# Altium schematic sheet Sheet1.SchDoc
size A3; SheetNumber: 1; SheetTotal: 1
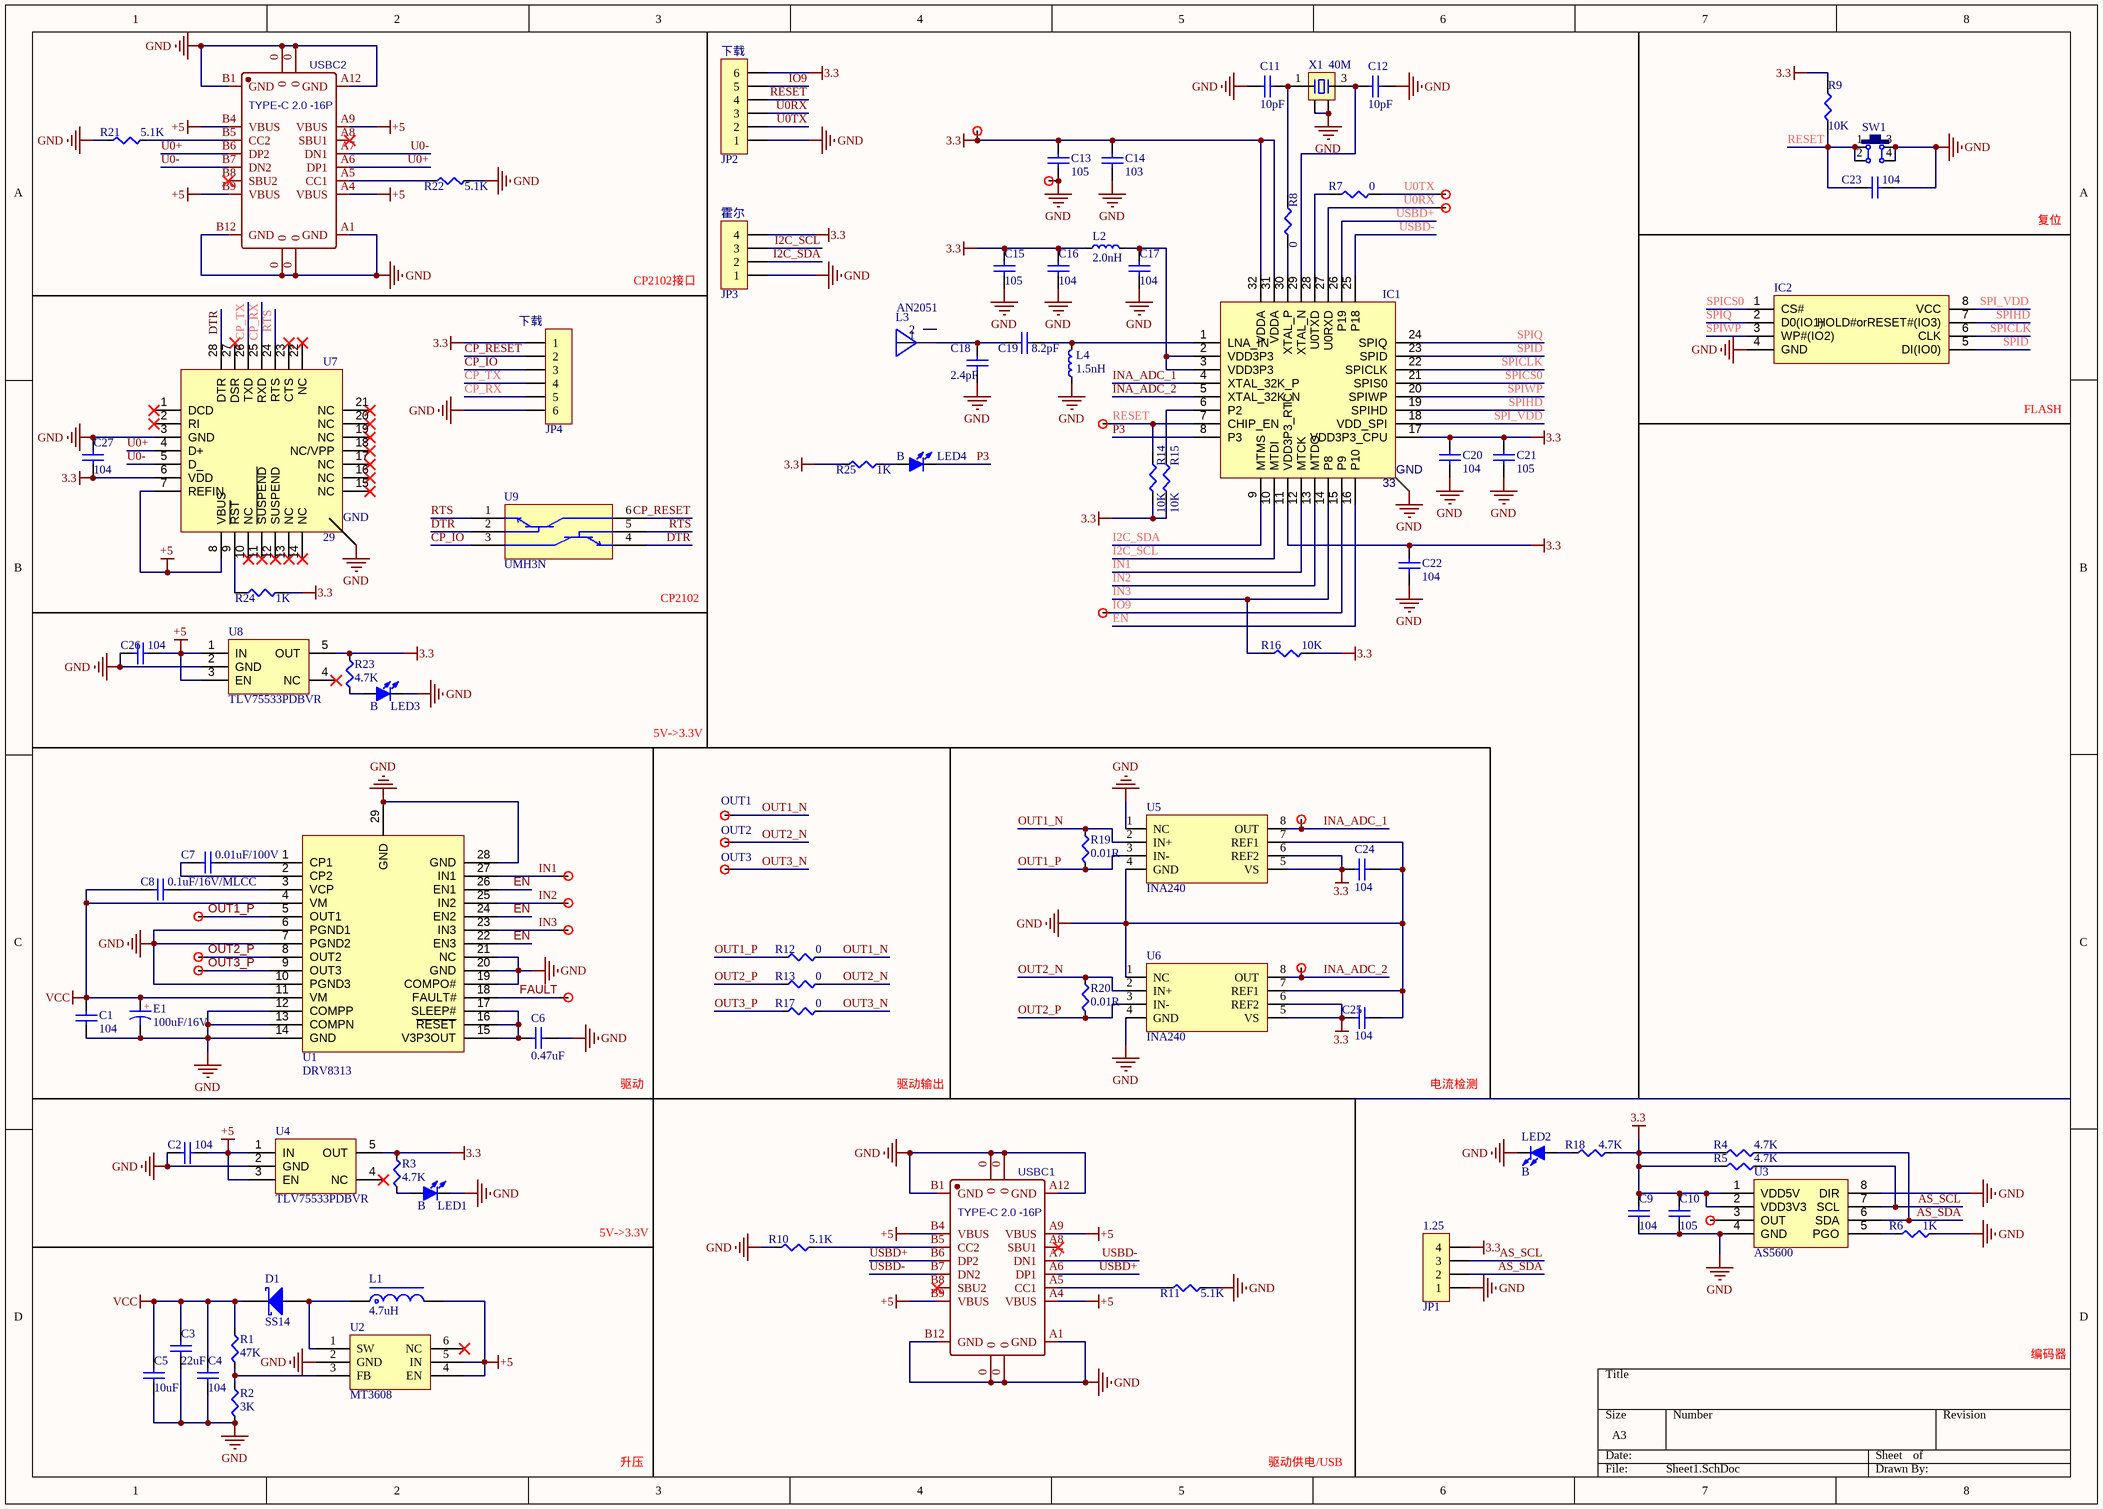
[diagram p0: Sheet1.SchDoc]

## Parts
C1  104  [C 0603_L]
C2  104  [C 0603_L]
C3  22uF  [C 1206_L]
C4  104  [C 0603_L]
C5  10uF  [C 0603_L]
C6  0.47uF  [C 0603_L]
C7  0.01uF/100V  [C 0603_L]
C8  0.1uF/16V/MLCC  [C 0603_L]
C9  104  [C 0603_L]
C10  105  [C 0603_L]
C11  10pF  [C 0603_L]
C12  10pF  [C 0603_L]
C13  105  [C 0603_L]
C14  103  [C 0603_L]
C15  105  [C 0603_L]
C16  104  [C 0603_L]
C17  104  [C 0603_L]
C18  2.4pF  [C 0603_L]
C19  8.2pF  [C 0603_L]
C20  104  [C 0603_L]
C21  105  [C 0603_L]
C22  104  [C 0603_L]
C23  104  [C 0603_L]
C24  104  [C 0603_L]
C25  104  [C 0603_L]
C26  104  [C 0603_L]
C27  104  [C 0603_L]
D1  SS14  [SMA]
E1  100uF/16V  [CM D(6.3*5.4)]
HP1  HP  [HP1x0.5]  (value not drawn)
HP2  HP  [HP1x0.5]  (value not drawn)
HP3  HP  [HP1x0.5]  (value not drawn)
HP4  HP  [HP1x0.5]  (value not drawn)
HP5  HP  [HP1x0.5]  (value not drawn)
HP6  HP  [HP1x0.5]  (value not drawn)
HP7  HP  [HP1x0.5]  (value not drawn)
HP8  HP  [HP1x0.5]  (value not drawn)
HP9  OUT1  [HP1x0.5]
HP10  OUT2  [HP1x0.5]
HP11  OUT3  [HP1x0.5]
HP12  HP  [HP1x0.5]  (value not drawn)
HP13  HP  [HP1x0.5]  (value not drawn)
HP14  HP  [HP1x0.5]  (value not drawn)
HP15  HP  [HP1x0.5]  (value not drawn)
HP16  HP  [HP1x0.5]  (value not drawn)
HP17  HP  [HP1x0.5]  (value not drawn)
HP18  HP  [HP1x0.5]  (value not drawn)
HP19  HP  [HP1x0.5]  (value not drawn)
IC1  ESP32-C3  [ESP32-C3]  (value not drawn)
IC2  W25Q64  [SOIC-8W]  (value not drawn)
JP1  HDR-1X4  [MX 1.25-WI-4P]  (value not drawn)
JP2  HDR-1X6  [MX 1.25-WI-6P]  (value not drawn)
JP3  HDR-1X4  [MX 1.25-WI-4P]  (value not drawn)
JP4  HDR-1X6  [MX 1.25-WI-6P]  (value not drawn)
L1  4.7uH  [NR4020]
L2  2.0nH  [L 0805]
L3  AN2051  [AN2051-245 2.4G]
L4  1.5nH  [L 0805]
LED1  B  [LED 0603B]
LED2  B  [LED 0603B]
LED3  B  [LED 0603B]
LED4  B  [LED 0603B]
R1  47K  [R 0603_L]
R2  3K  [R 0603_L]
R3  4.7K  [R 0603_L]
R4  4.7K  [R 0603_L]
R5  4.7K  [R 0603_L]
R6  1K  [R 0603_L]
R7  0  [R 0603_L]
R8  0  [R 0603_L]
R9  10K  [R 0603_L]
R10  5.1K  [R 0603_L]
R11  5.1K  [R 0603_L]
R12  0  [R 0603_L]
R13  0  [R 0603_L]
R14  10K  [R 0603_L]
R15  10K  [R 0603_L]
R16  10K  [R 0603_L]
R17  0  [R 0603_L]
R18  4.7K  [R 0603_L]
R19  0.01R  [R 1206_L]
R20  0.01R  [R 1210_L]
R21  5.1K  [R 0603_L]
R22  5.1K  [R 0603_L]
R23  4.7K  [R 0603_L]
R24  1K  [R 0603_L]
R25  1K  [R 0603_L]
SW1  3.2x4.2x5  [TSW SMD 3.2*4.2*2.5]  (value not drawn)
U1  DRV8313  [HTSSOP-28-EP-4.5mm]
U2  MT3608  [SOT23-6L]
U3  AS5600  [SOIC-8]
U4  TLV75533PDBVR  [SOT23-5L]
U5  INA240  [TSSOP8_N]
U6  INA240  [TSSOP8_N]
U7  CP2102  [QFN28 5x5_M]  (value not drawn)
U8  TLV75533PDBVR  [SOT23-5L]
U9  UMH3N  [SOT-363]
USBC1  TYPE-C 2.0 -16P  [USB-C-SMD_TYPE-C-USB-5]
USBC2  TYPE-C 2.0 -16P  [USB-C-SMD_TYPE-C-USB-5]
X1  40M  [OSC 3225-4P]

## Nets
3.3: C9.2 C10.2 C13.2 C14.2 C15.2 C16.2 C20.2 C21.2 C22.2 C24.2 C25.1 C27.1 HP18.1 IC1.11(VDD3P3_RTC) IC1.17(VDD3P3_CPU) IC1.31(VDDA) IC1.32(VDDA) JP1.4 JP2.6 JP3.4 JP4.1 L2.1 R3.2 R4.1 R5.1 R9.2 R14.1 R15.1 R16.2 R18.2 R23.2 R24.1 R25.1 U3.1(VDD5V) U3.2(VDD3V3) U4.5(OUT) U5.5(VS) U5.6(REF2) U6.5(VS) U6.6(REF2) U7.6(VDD) U8.5(OUT)
+5: C2.2 C26.2 L1.2 U2.4(EN) U2.5(IN) U4.1(IN) U4.3(EN) U7.7(REFIN) U7.8(VBUS) U8.1(IN) U8.3(EN) USBC1.A4(VBUS) USBC1.A9(VBUS) USBC1.B4(VBUS) USBC1.B9(VBUS) USBC2.A4(VBUS) USBC2.A9(VBUS) USBC2.B4(VBUS) USBC2.B9(VBUS)
GND: C1.1 C2.1 C3.1 C4.1 C5.1 C6.1 C9.1 C10.1 C11.1 C12.2 C13.1 C14.1 C15.1 C16.1 C17.1 C18.1 C20.1 C21.1 C22.1 C23.2 C24.1 C25.2 C26.1 C27.2 E1.2 HP19.1 IC1.33(GND) IC2.4(GND) JP1.1 JP2.1 JP3.1 JP4.6 L4.1 LED1.2(K) LED2.2(K) LED3.2(K) R2.1 R6.2 R10.1 R11.2 R21.1 R22.2 SW1.3 SW1.4 U1.6(PGND1) U1.7(PGND2) U1.10(PGND3) U1.12(COMPP) U1.13(COMPN) U1.14(GND) U1.19(COMPO#) U1.20(GND) U1.21(NC) U1.28(GND) U1.29(GND) U2.2(GND) U3.4(GND) U3.8(DIR) U4.2(GND) U5.1(NC) U5.4(GND) U5.7(REF1) U6.1(NC) U6.4(GND) U6.7(REF1) U7.3(GND) U7.29(GND) U8.2(GND) USBC1.0 USBC1.A1(GND) USBC1.A12(GND) USBC1.B1(GND) USBC1.B12(GND) USBC2.0 USBC2.A1(GND) USBC2.A12(GND) USBC2.B1(GND) USBC2.B12(GND) X1.2 X1.4
VCC: C1.2 C3.2 C4.2 C5.2 C8.1 D1.2(K) E1.1 R1.2 U1.4(VM) U1.11(VM)
AS_SCL: JP1.3 R5.2 U3.7(SCL)
AS_SDA: JP1.2 R4.2 U3.6(SDA)
CP_IO: JP4.3 U9.3(C2)
CP_RESET: JP4.2 U9.6(C1)
CP_RX: JP4.5 U7.25(RXD)
CP_TX: JP4.4 U7.26(TXD)
DTR: U7.28(DTR) U9.2(B2) U9.4(E2)
EN: IC1.16(P10) U1.22(EN3) U1.24(EN2) U1.26(EN1)
FAULT: HP7.1 U1.18(FAULT#)
I2C_SCL: IC1.10(MTDI) JP3.3
I2C_SDA: IC1.9(MTMS) JP3.2
IN1: HP1.1 IC1.12(MTCK) U1.27(IN1)
IN2: HP2.1 IC1.13(MTDO) U1.25(IN2)
IN3: HP4.1 IC1.14(P8) R16.1 U1.23(IN3)
INA_ADC_1: HP12.1 IC1.4(XTAL_32K_P) U5.8(OUT)
INA_ADC_2: HP14.1 IC1.5(XTAL_32K_N) U6.8(OUT)
IO9: HP17.1 IC1.15(P9) JP2.5
OUT1_N: HP9.1 R12.2 R19.2 U5.2(IN+)
OUT1_P: HP3.1 R12.1 R19.1 U1.5(OUT1) U5.3(IN-)
OUT2_N: HP10.1 R13.2 R20.2 U6.2(IN+)
OUT2_P: HP5.1 R13.1 R20.1 U1.8(OUT2) U6.3(IN-)
OUT3_N: HP11.1 R17.2
OUT3_P: HP6.1 R17.1 U1.9(OUT3)
P3: IC1.8(P3) LED4.2(K)
RESET: C23.1 HP16.1 IC1.7(CHIP_EN) JP2.4 R9.1 R14.2 SW1.1 SW1.2
RTS: U7.24(RTS) U9.1(E1) U9.5(B2)
SPI_VDD: IC1.18(VDD_SPI) IC2.8(VCC)
SPICLK: IC1.22(SPICLK) IC2.6(CLK)
SPICS0: IC1.21(SPIS0) IC2.1(CS#)
SPID: IC1.23(SPID) IC2.5(DI(IO0))
SPIHD: IC1.19(SPIHD) IC2.7(HOLD#orRESET#(IO3))
SPIQ: IC1.24(SPIQ) IC2.2(D0(IO1))
SPIWP: IC1.20(SPIWP) IC2.3(WP#(IO2))
U0+: U7.4(D+) USBC2.A6(DP1) USBC2.B6(DP2)
U0-: U7.5(D_) USBC2.A7(DN1) USBC2.B7(DN2)
U0RX: HP15.1 IC1.27(U0RXD) JP2.3
U0TX: HP13.1 JP2.2 R7.2
USBD+: IC1.26(P19) USBC1.A6(DP1) USBC1.B6(DP2)
USBD-: IC1.25(P18) USBC1.A7(DN1) USBC1.B7(DN2)
NetC6_2: C6.2 U1.15(V3P3OUT) U1.16(~{RESET}) U1.17(SLEEP#)
NetC7_1: C7.1 U1.1(CP1)
NetC7_2: C7.2 U1.2(CP2)
NetC8_2: C8.2 U1.3(VCP)
NetC11_2: C11.2 R8.2 X1.1
NetC12_1: C12.1 IC1.29(XTAL_N) X1.3
NetC17_2: C17.2 IC1.2(VDD3P3) IC1.3(VDD3P3) L2.2
NetC18_2: C18.2 C19.2 L3.1
NetC19_1: C19.1 IC1.1(LNA_IN) L4.2
NetD1_1: D1.1(A) L1.1 U2.1(SW)
NetHP8_1: HP8.1 U3.3(OUT)
NetIC1_6: IC1.6(P2) R15.2
NetIC1_28: IC1.28(U0TXD) R7.1
NetIC1_30: IC1.30(XTAL_P) R8.1
NetLED1_1: LED1.1(A) R3.1
NetLED2_1: LED2.1(A) R18.1
NetLED3_1: LED3.1(A) R23.1
NetLED4_1: LED4.1(A) R25.2
NetR1_1: R1.1 R2.2 U2.3(FB)
NetR6_1: R6.1 U3.5(PGO)
NetR10_2: R10.2 USBC1.B5(CC2)
NetR11_1: R11.1 USBC1.A5(CC1)
NetR21_2: R21.2 USBC2.B5(CC2)
NetR22_1: R22.1 USBC2.A5(CC1)
NetR24_2: R24.2 U7.9(~{RST})

Not connected (* = marked no-connect by the designer): L3 2; U2 6(NC)*; U4 4(NC)*; U7 1(DCD)* 2(RI)* 10(NC)* 11(~{SUSPEND})* 12(SUSPEND)* 13(NC)* 14(NC)* 15(NC)* 16(NC)* 17(NC)* 18(NC/VPP)* 19(NC)* 20(NC)* 21(NC)* 22(NC)* 23(CTS)* 27(DSR)*; U8 4(NC)*; USBC1 A8(SBU1)* B8(SBU2)*; USBC2 A8(SBU1)* B8(SBU2)*

## Notes on the sheet
- (near JP2) 下载
- (near JP3) 霍尔
- 复位
- CP2102接口
- (near JP4) 下载
- FLASH
- CP2102
- 5V->3.3V
- 驱动
- 驱动输出
- 电流检测
- (near JP1) 1.25
- 编码器
- 升压
- 驱动供电/USB
- (in symbol CE_SMD) +

## Library data of the parts
C1-C27 = C: 贴片电容; BOM名称: 无极性贴片电容; 联系卖家，免费查找封装: 唯一出售店铺网址https://shop463601444.taobao.com; 封装库来自淘宝卖家ID：黄晶宝石: 其他店铺购入均为盗版假冒封装库
D1 = SS14: 肖特基二极管; 属性: 40V/1A; 联系卖家，免费查找封装: 唯一出售店铺网址https://shop463601444.taobao.com; BOM名称: 肖特基二极管
E1 = CE_SMD: 贴片电解电容; 联系卖家，免费查找封装: 唯一出售店铺网址https://shop463601444.taobao.com; 封装库来自淘宝卖家ID：黄晶宝石: 其他店铺购入均为盗版假冒封装库; BOM名称: 贴片电解电容
HP1-HP19 = HP: 引脚测试点
IC1 = ESP32-C3: ESP32-C3 QFN-32(5x5)
JP1 JP3 = Header 4: 4P接插件; 联系卖家，免费技术支持: 唯一出售店铺网址https://shop463601444.taobao.com; BOM名称: 4P接插件
JP2 JP4 = Header 6: 6P接插件; 联系卖家，免费技术支持: 唯一出售店铺网址https://shop463601444.taobao.com; BOM名称: 6P接插件
L1 = L-NR: NR磁胶电感; 联系卖家，免费查找封装: 唯一出售店铺网址https://shop463601444.taobao.com; 封装库来自淘宝卖家ID：黄晶宝石: 其他店铺购入均为盗版假冒封装库; BOM名称: NR磁胶电感
L2 L4 = L: 小功率贴片电感; 联系卖家，免费查找封装: 唯一出售店铺网址https://shop463601444.taobao.com; 封装库来自淘宝卖家ID：黄晶宝石: 其他店铺购入均为盗版假冒封装库; BOM名称: 小功率贴片电感
L3 = AN2051: AN2051-245 2.4G蓝牙wifi 贴片 2051
LED1-LED4 = B: 贴片LED; 封装库来自淘宝卖家 ID：黄晶宝石: 其他店铺购入均为假冒，请立即申请退款，本店奖励2~5元现金; BOM名称: 贴片LED
R1-R25 = R: 贴片电阻; 联系卖家，免费查找封装: 唯一出售店铺网址https://shop463601444.taobao.com; 封装库来自淘宝卖家ID：黄晶宝石: 其他店铺购入均为盗版假冒封装库; BOM名称: 贴片电阻
SW1 = TSW SMD-3.2x4.2: 贴片4.2*3.2轻触开关
U1 = DRV8313: DRV8313 无刷直流BLDC 8V~60V三路半H桥驱动器IC
U2 = MT3608: DCDC 升压1.2MHZ 2A / 97%
U3 = AS5600: AS5600 12bit磁角度位置传感器
U4 U8 = TLV75533PDBVR: Vout:3.3V;Vin:1.45~5.5V,500ma;低压降
U5 U6 = INA240: 具有增强的 PWM 抑制能力的 -4V 至 80V、双向、超精密电流感应放大器
U7 = CP2102: USB转TTL
U9 = UMH3N: 2NPN预偏式(双)
USBC1 USBC2 = USB2.0 Type-C 16Pin母座: USB2.0 Type-C 母座 16Pin; 联系卖家，免费技术支持: 唯一出售店铺网址https://shop463601444.taobao.com
X1 = XTAL-4P: 4脚无源晶振; 联系卖家，免费查找封装: 唯一出售店铺网址https://shop463601444.taobao.com; BOM名称: 4脚无源晶振